# Altium schematic sheet UPS_Charger_v1.SchDoc
size 297 x 209 mm
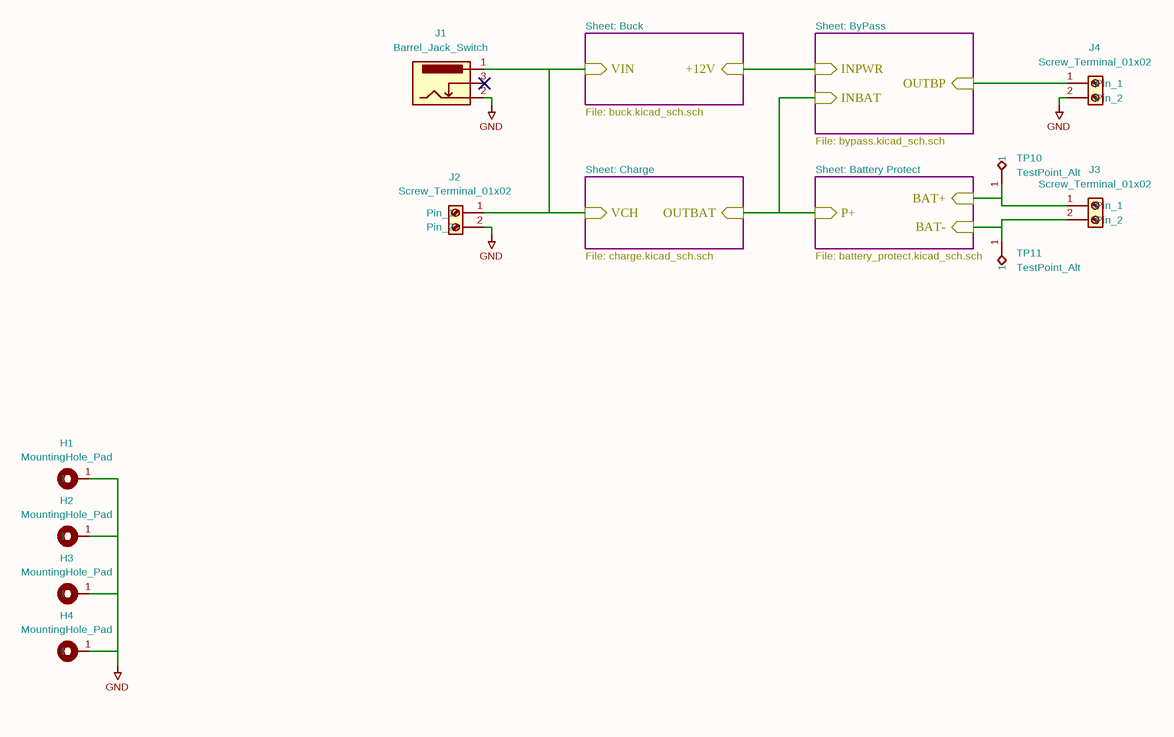
[diagram p0: UPS_Charger_v1.SchDoc]

## Parts
H1  MountingHole_Pad  [MountingHole_3.2mm_M3_Pad_Via]
H2  MountingHole_Pad  [MountingHole_3.2mm_M3_Pad_Via]
H3  MountingHole_Pad  [MountingHole_3.2mm_M3_Pad_Via]
H4  MountingHole_Pad  [MountingHole_3.2mm_M3_Pad_Via]
J1  Barrel_Jack_Switch  [BarrelJack_GCT_DCJ200-10-A_Horizontal]
J2  Screw_Terminal_01x02  [TerminalBlock_RND_205-00232_1x02_P5.08mm_Horizontal]
J3  Screw_Terminal_01x02  [TerminalBlock_RND_205-00232_1x02_P5.08mm_Horizontal]
J4  Screw_Terminal_01x02  [TerminalBlock_RND_205-00232_1x02_P5.08mm_Horizontal]
TP10  TestPoint_Alt  [TestPoint_Bridge_Pitch5.08mm_Drill1.3mm]
TP11  TestPoint_Alt  [TestPoint_Bridge_Pitch5.08mm_Drill1.3mm]

## Sub-sheets
Battery Protect = battery_protect.SchDoc: BAT+ (in), BAT- (in), P+ (in)
Buck = buck.SchDoc: +12V (in), VIN (in)
ByPass = bypass.SchDoc: INBAT (in), INPWR (in), OUTBP (in)
Charge = charge.SchDoc: OUTBAT (in), VCH (in)

## Nets
GND: H1.1 H2.1 H3.1 H4.1 J1.2 J2.2(Pin_2) J4.2(Pin_2)
NetJ1_1: J1.1 J2.1(Pin_1) ; sheet Buck/VIN, sheet Charge/VCH
NetJ3_1: J3.1(Pin_1) TP10.1 ; sheet Battery Protect/BAT+
NetJ3_2: J3.2(Pin_2) TP11.1 ; sheet Battery Protect/BAT-
NetJ4_1: J4.1(Pin_1) ; sheet ByPass/OUTBP
(unnamed): sheet ByPass/INBAT, sheet Battery Protect/P+, sheet Charge/OUTBAT
(unnamed): sheet ByPass/INPWR, sheet Buck/+12V

Not connected (* = marked no-connect by the designer): J1 3*

## Notes on the sheet
- Sheet: Buck
- Sheet: ByPass
- File: buck.kicad_sch.sch
- File: bypass.kicad_sch.sch
- Sheet: Charge
- Sheet: Battery Protect
- File: charge.kicad_sch.sch
- (near TP11) File: battery_protect.kicad_sch.sch
- 1
- 2
- 3
- 4
- 5
- 6
- A
- B
- C
- D
- Title: UPS Lead Acid
- File: ups_lead_acid_electgpl_v1.0.kicad_sch
- Sheet: /
- Electgpl
- KiCad E.D.A.  kicad (5.1.4)-1
- Size: A4
- Date: 2025-06-05
- Rev: 1.0
- Id: 1/1

## Library data of the parts
H1-H4 = MountingHole_Pad: Description: Mounting Hole with connection; Value: MountingHole_Pad; Footprint: MountingHole:MountingHole_3.2mm_M3_Pad_Via
J1 = Barrel_Jack_Switch: MFR P/N: DC-470-2.1GP; Description: DC Barrel Jack with an internal switch; LCSC: C194407; Value: Barrel_Jack_Switch; Footprint: Connector_BarrelJack:BarrelJack_GCT_DCJ200-10-A_Horizontal
J2-J4 = Screw_Terminal_01x02: MFR P/N: WJ500V-5.08-2P; Description: Generic screw terminal, single row, 01x02, script generated (kicad-library-utils/schlib/autogen/connector/); LCSC: C8465; Value: Screw_Terminal_01x02; Footprint: TerminalBlock_RND:TerminalBlock_RND_205-00232_1x02_P5.08mm_Horizontal
TP10 TP11 = TestPoint_Alt: Description: test point (alternative shape); Value: TestPoint_Alt; Footprint: TestPoint:TestPoint_Bridge_Pitch5.08mm_Drill1.3mm